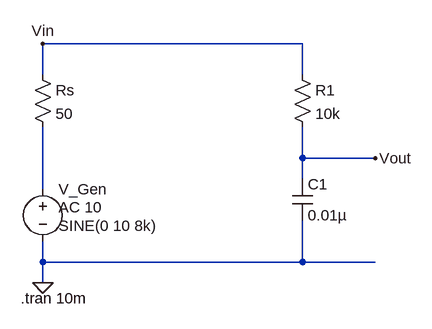
[diagram p0: schematic Lab1.asc]
Lab1.asc, the LTspice schematic file:
Version 4
SHEET 1 880 680
WIRE 448 -96 48 -96
WIRE 48 -48 48 -96
WIRE 448 -48 448 -96
WIRE 448 80 448 32
WIRE 560 80 448 80
WIRE 448 112 448 80
WIRE 48 128 48 32
WIRE 48 240 48 208
WIRE 448 240 448 176
WIRE 448 240 48 240
WIRE 560 240 448 240
WIRE 48 272 48 240
FLAG 48 272 0
FLAG 48 -96 Vin
FLAG 560 80 Vout
SYMBOL voltage 48 112 R0
WINDOW 123 24 44 Left 2
WINDOW 39 0 0 Left 0
WINDOW 3 24 72 Left 2
SYMATTR Value2 AC 10
SYMATTR InstName V_Gen
SYMATTR Value SINE(0 10 8k)
SYMBOL res 32 -64 R0
SYMATTR InstName Rs
SYMATTR Value 50
SYMBOL res 432 -64 R0
SYMATTR InstName R1
SYMATTR Value 10k
SYMBOL cap 432 112 R0
SYMATTR InstName C1
SYMATTR Value 0.01µ
TEXT 14 296 Left 2 !.tran 10m

The netlist it stands for:
* Lab1.asc
V_Gen N001 0 SINE(0 10 8k) AC 10
Rs Vin N001 50
R1 Vin Vout 10k
C1 Vout 0 0.01µ
.tran 10m
.backanno
.end